# EAGLE design 388_Project (EAGLE 7.7.0)
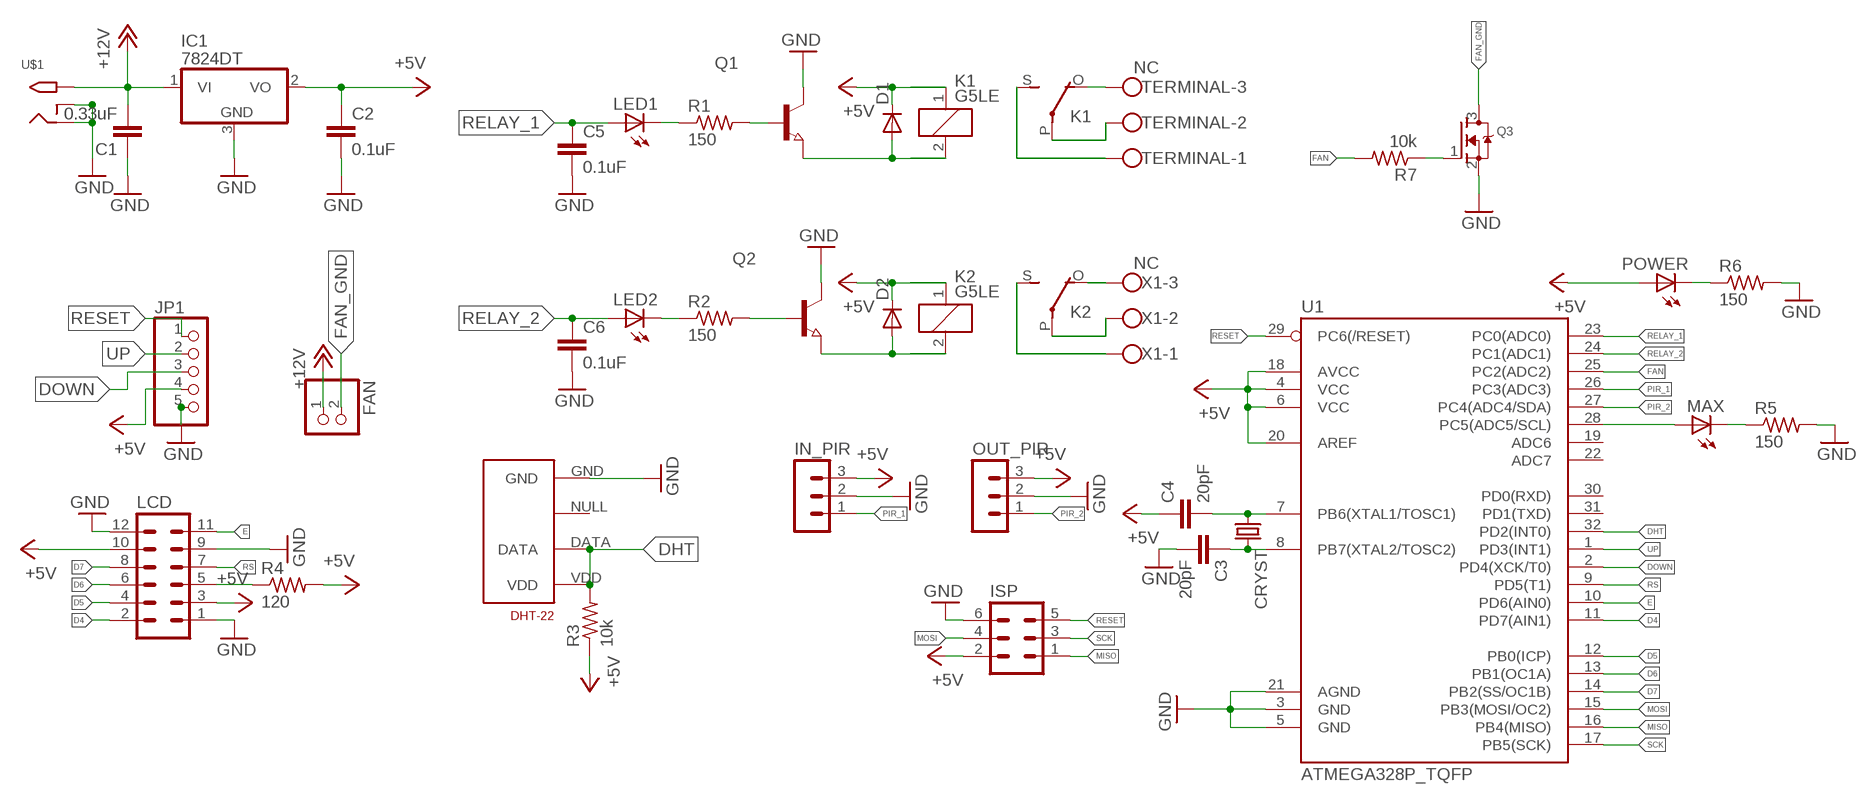
[diagram p0: schematic, sheet 1]

## Parts
C1  0.33uF  CAP0805  [0805]
C2  0.1uF  CAP0805  [0805]
C3  20pF  CAP0805  [0805]
C4  20pF  CAP0805  [0805]
C5  0.1uF  CAP0805  [0805]
C6  0.1uF  CAP0805  [0805]
CRYST  CRYSTALHC49UP  [HC49UP]
D1  DIODE-DO-214AC  [DO-214AC]
D2  DIODE-DO-214AC  [DO-214AC]
DHT-22  RHT03_DHT-22_AM2302RA  [RHT03_DHT-22/RA]
FAN  JST_2PIN-SMT  [JST-PH-2-SMT]
IC1  7824DT  [TO252]
IN_PIR  MA03-1  [MA03-1]
ISP  MA03-2  [MA03-2]
JP1  PINHD-1X5  [1X05]
K1  G5LE  [G5LE]
K2  G5LE  [G5LE]
LCD  MA06-2  [MA06-2]
LED1  LEDSML0805  [SML0805]
LED2  LEDSML0805  [SML0805]
MAX  LEDSML0805  [SML0805]
OUT_PIR  MA03-1  [MA03-1]
POWER  LEDSML0805  [SML0805]
Q1  NPN-TRANSISTOR_SOT23  [SOT23]
Q2  NPN-TRANSISTOR_SOT23  [SOT23]
Q3  MOSFET-NREFLOW  [SOT23]
R1  150  R-US_M0805  [M0805]
R2  150  R-US_M0805  [M0805]
R3  10k  R-US_M0805  [M0805]
R4  120  R-US_M0805  [M0805]
R5  150  R-US_M0805  [M0805]
R6  150  R-US_M0805  [M0805]
R7  10k  R-US_M0805  [M0805]
TERMINAL  NC  W237-103  [W237-103]
U1  ATMEGA328P_TQFP  [TQFP32-08]
U$1  2.1MMJACKTHM  [PJ-102A]
X1  NC  W237-103  [W237-103]

## Nets
+5V: C2.1 C4.1 D1.C D2.C IC1.2(VO) IN_PIR.3 ISP.2 JP1.4 K1.1 K2.1 LCD.3 LCD.10 OUT_PIR.3 POWER.A R3.1 R4.2 U1.4(VCC) U1.6(VCC) U1.18(AVCC) U1.20(AREF)
+12V: C1.2 FAN.1 IC1.1(VI) U$1.TIP
D4: LCD.2 U1.11(PD7(AIN1))
D5: LCD.4 U1.12(PB0(ICP))
D6: LCD.6 U1.13(PB1(OC1A))
D7: LCD.8 U1.14(PB2(SS/OC1B))
DHT: DHT-22.DATA DHT-22.VDD R3.2 U1.32(PD2(INT0))
DOWN: JP1.3 U1.2(PD4(XCK/T0))
E: LCD.11 U1.10(PD6(AIN0))
FAN: R7.2 U1.25(PC2(ADC2))
FAN_GND: FAN.2 Q3.3(D)
GND: C1.1 C2.2 C3.2 C5.2 C6.2 DHT-22.GND IC1.3(GND) IN_PIR.2 ISP.6 JP1.5 LCD.1 LCD.9 LCD.12 OUT_PIR.2 Q1.3(C) Q2.3(C) Q3.2(S) R5.2 R6.2 U1.3(GND) U1.5(GND) U1.21(AGND) U$1.RING U$1.RING_SW
MISO: ISP.1 U1.16(PB4(MISO))
MOSI: ISP.4 U1.15(PB3(MOSI/OC2))
N$1: K1.O(2:O) TERMINAL.3
N$2: Q3.1(G) R7.1
N$3: C3.1 CRYST.2 U1.8(PB7(XTAL2/TOSC2))
N$4: C4.2 CRYST.1 U1.7(PB6(XTAL1/TOSC1))
N$5: K1.S(2:S) TERMINAL.1
N$6: K1.P(2:P) TERMINAL.2
N$7: LED1.C R1.1
N$8: LED2.C R2.1
N$9: Q1.1(B) R1.2
N$10: Q2.1(B) R2.2
N$11: D1.A K1.2 Q1.2(E)
N$12: D2.A K2.2 Q2.2(E)
N$13: MAX.A U1.28(PC5(ADC5/SCL))
N$14: MAX.C R5.1
N$15: POWER.C R6.1
N$16: K2.O(2:O) X1.3
N$17: K2.S(2:S) X1.1
N$18: K2.P(2:P) X1.2
N$25: LCD.5 R4.1
PIR_1: IN_PIR.1 U1.26(PC3(ADC3))
PIR_2: OUT_PIR.1 U1.27(PC4(ADC4/SDA))
RELAY_1: C5.1 LED1.A U1.23(PC0(ADC0))
RELAY_2: C6.1 LED2.A U1.24(PC1(ADC1))
RESET: ISP.5 JP1.1 U1.29(PC6(/RESET))
RS: LCD.7 U1.9(PD5(T1))
SCK: ISP.3 U1.17(PB5(SCK))
UP: JP1.2 U1.1(PD3(INT1))
Unconnected: DHT-22.NULL U1.19(ADC6) U1.22(ADC7) U1.30(PD0(RXD)) U1.31(PD1(TXD))

## Library data of the parts
C1-C6 = SparkFun-Capacitors:CAP: Capacitor Standard 0603 ceramic capacitor, and 0.1" leaded capacitor.
CRYST = crystal:CRYSTAL: CRYSTAL; OC_FARNELL: unknown; OC_NEWARK: unknown
D1 D2 = diode:DIODE-: DIODE
DHT-22 = RHT03_DHT-22_AM2302:RHT03_DHT-22_AM2302: RHT03 / DHT-22 / AM2302 Packages and symbol for the RHT03 / DHT-22 relative humidity and temperature sensor. Note: The AM2302 is a wired version of the DHT-22 which typically requires less clearance and is thus provided as a separate package.; PROD_ID: SEN-10167
FAN = adafruit:JST_2PIN: JST 2-Pin Connectors of various flavors SMT-RA (S2B-PH-SM4) 4UConnector #17311 SMT (B2B-PH-SM4) THM-RA (S2B-PH) THM (B2B-PH)
IC1 = linear:78*: Positive VOLTAGE REGULATOR Source: http://cache.national.com/ds/LM/LM78L05.pdf http://www.fairchildsemi.com/ds/LM/LM7805.pdf
IN_PIR OUT_PIR = con-lstb:MA03-1: PIN HEADER; OC_FARNELL: unknown; OC_NEWARK: unknown
ISP = con-lstb:MA03-2: PIN HEADER; OC_FARNELL: unknown; OC_NEWARK: unknown
JP1 = pinhead:PINHD-1X5: PIN HEADER
K1 K2 = ECE388:G5LE: RELAY 1 x switch, 10 A/120 V AC, 8 A/30 V DC, Omron; OC_FARNELL: unknown; OC_NEWARK: unknown
LCD = con-lstb:MA06-2: PIN HEADER; OC_FARNELL: unknown; OC_NEWARK: unknown
LED1 LED2 MAX POWER = led:LED: LED OSRAM: - CHIPLED LG R971, LG N971, LY N971, LG Q971, LY Q971, LO R971, LY R971 LH N974, LH R974 LS Q976, LO Q976, LY Q976 LO Q996 - Hyper CHIPLED LW Q18S LB Q993, LB Q99A, LB R99A - SideLED LS A670, LO A670, LY A670, LG A670, LP A670 LB A673, LV A673, LT A673, LW A673 LH A674 LY A675 LS A676, LA A676, LO A676, LY A676, LW A676 LS A679, LY A679, LG A679 - Hyper Micro SIDELED® LS Y876, LA Y876, LO Y876, LY Y876 LT Y87S - SmartLED LW L88C, LW L88S LB L89C, LB L89S, LG L890 LS L89K, LO L89K, LY L89K LS L896, LA L896, LO L896, LY L896 - TOPLED LS T670, LO T670, LY T670, LG T670, LP T670 LSG T670, LSP T670, LSY T670, LOP T670, LYG T670 LG T671, LOG T671, LSG T671 LB T673, LV T673, LT T673, LW T673 LH T674 LS T676, LA T676, LO T676, LY T676, LB T676, LH T676, LSB T676, LW T676 LB T67C, LV T67C, LT T67C, LS T67K, LO T67K, LY T67K, LW E67C LS E67B, LA E67B, LO E67B, LY E67B, LB E67C, LV E67C, LT E67C LW T67C LS T679, LY T679, LG T679 LS T770, LO T770, LY T770, LG T770, LP T770 LB T773, LV T773, LT T773, LW T773 LH T774 LS E675, LA E675, LY E675, LS T675 LS T776, LA T776, LO T776, LY T776, LB T776 LHGB T686 LT T68C, LB T68C - Hyper Mini TOPLED® LB M676 - Mini TOPLED Santana® LG M470 LS M47K, LO M47K, LY M47K Source: http://www.osram.convergy.de LUXEON: - LUMILED® LXK2-PW12-R00, LXK2-PW12-S00, LXK2-PW14-U00, LXK2-PW14-V00 LXK2-PM12-R00, LXK2-PM12-S00, LXK2-PM14-U00 LXK2-PE12-Q00, LXK2-PE12-R00, LXK2-PE12-S00, LXK2-PE14-T00, LXK2-PE14-U00 LXK2-PB12-K00, LXK2-PB12-L00, LXK2-PB12-M00, LXK2-PB14-N00, LXK2-PB14-P00, LXK2-PB14-Q00 LXK2-PR12-L00, LXK2-PR12-M00, LXK2-PR14-Q00, LXK2-PR14-R00 LXK2-PD12-Q00, LXK2-PD12-R00, LXK2-PD12-S00 LXK2-PH12-R00, LXK2-PH12-S00 LXK2-PL12-P00, LXK2-PL12-Q00, LXK2-PL12-R00 Source: www.luxeon.com KINGBRIGHT: KA-3528ASYC Source: www.kingbright.com
Q1 Q2 = semicon-smd-ipc:NPN-TRANSISTOR_: NPN TRANSISTOR
Q3 = adafruit:MOSFET-N: N-Channel Mosfet 2N7002E - 60V 260mA SOT23 [Digikey: 2N7002ET1GOSTR-ND] - REEL BSH103 - 30V 850mA SOT23 [Digikey: 568-5013-1-ND]
R1-R7 = resistor:R-US_: RESISTOR, American symbol
TERMINAL X1 = con-wago-500:W237-103: WAGO SCREW CLAMP; MPN: 237-103; OC_FARNELL: unknown; OC_NEWARK: 18M7116
U1 = SparkFun-DigitalIC:ATMEGA328P_TQFP; PROD_ID: IC-09069
U$1 = ECE388:2.1MMJACK: 2.1mm x 5.5mm THM DC jack with internal switch. Digikey part #PJ-102A, 4UCON part #05537 2.1mm x 5.5mm SMT DC jack with internal switch. Digikey part #PJ-002A-SMT, 4UCON part #03267 By microbuilder.eu & adafruit.com

## Board
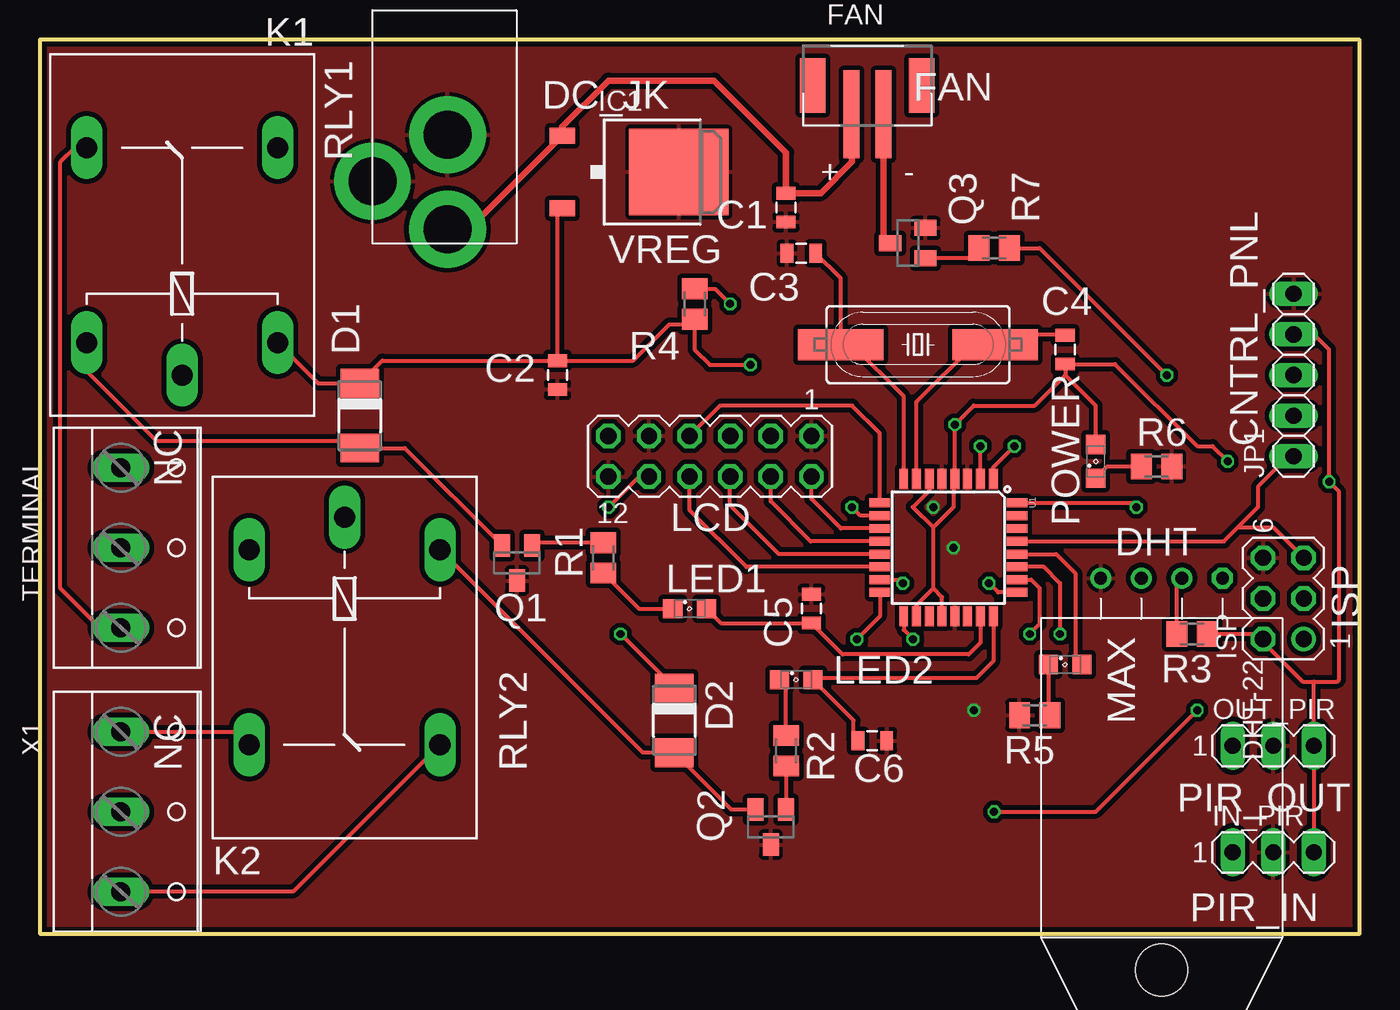
[diagram p1: board, top side]
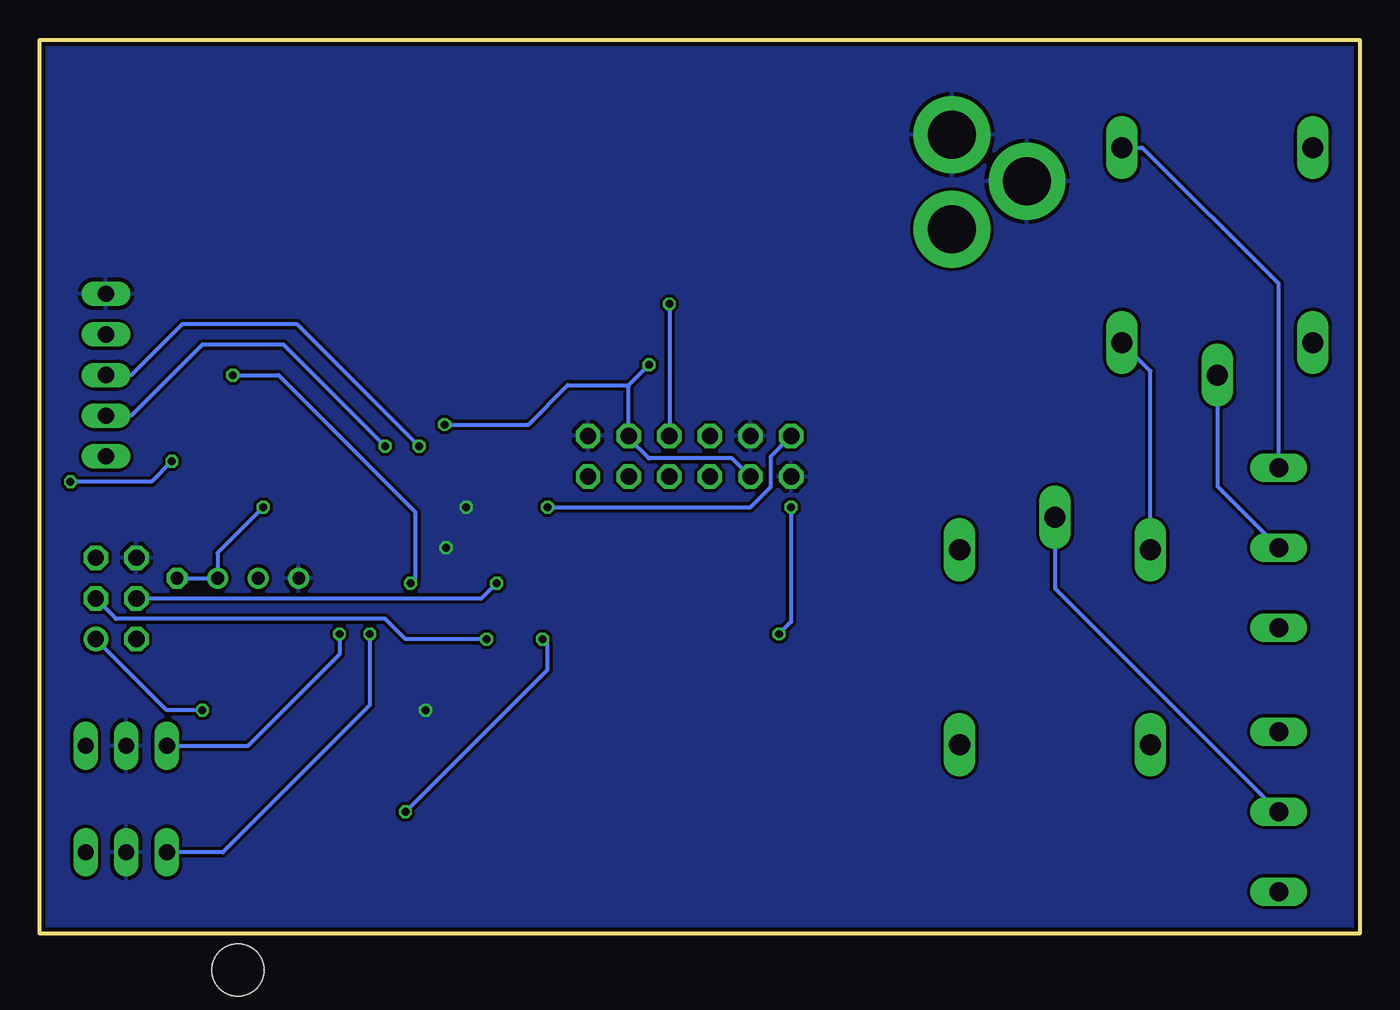
[diagram p2: board, bottom side, seen from below]

Size 82.55 x 55.88 mm. Coordinates in mm from the lower left corner, seen from the top.
Outline: 0,0 82.55,0 82.55,55.88 0,55.88 0,0
Copper layers (1*16): Top 0.035mm / dielectric 1.5mm / Bottom 0.035mm
Design rules "Dirty8TS": minimum track width 8mil, minimum drill 15mil, track to track 8mil, track to pad 8mil, pad to pad 8mil, via to via 8mil, smd to smd 0mil, copper to edge 10mil, drill to drill 10mil, minimum pad ring 10mil, minimum via ring 6mil, stop-mask expansion 2mil, vias tented up to drill 25mil, thermal gap 10mil

### Footprints (pad centres in the part's own frame; a part is rotated, then mirrored left to right if it is on the bottom)
0805 = smd 0.8 x 1.2: 1 -0.9,0; 2 0.9,0
HC49UP = smd 5.334 x 1.93: 1 -4.826,0; 2 4.826,0
DO-214AC = smd 1.8 x 2.4: A 2.025,0; C -2.025,0
RHT03_DHT-22/RA = drill 0.8: DATA -1.27,0; GND 3.81,0; NULL 1.27,0 | drill 0.8 octagon: VDD -3.81,0 | hole 3.25: 0,24.5
JST-PH-2-SMT = smd 1 x 5.5: 1 -1,-1.8; 2 1,-1.8 | smd 1.6 x 3.4: NC1 -3.4,0; NC2 3.4,0
TO252 = smd 1 x 1.6: 1 -2.28,-4.8; 2 2.28,-4.8 | smd 5.4 x 6.2: 3 0,2.5
MA03-1 = drill 1.016 long: 1 -2.54,0; 2 0,0; 3 2.54,0
MA03-2 = drill 1.016: 1 -2.54,-1.27 | drill 1.016 octagon: 2 -2.54,1.27; 3 0,-1.27; 4 0,1.27; 5 2.54,-1.27; 6 2.54,1.27
1X05 = drill 1.016 long: 1 -5.08,0; 2 -2.54,0; 3 0,0; 4 2.54,0; 5 5.08,0
G5LE = drill 1.321 long: 1 -7.493,-5.969; 2 -7.493,5.969; O 4.699,5.969; P -9.525,0; S 4.699,-5.969
MA06-2 = drill 1.016 octagon: 1 -6.35,-1.27; 2 -6.35,1.27; 3 -3.81,-1.27; 4 -3.81,1.27; 5 -1.27,-1.27; 6 -1.27,1.27; 7 1.27,-1.27; 8 1.27,1.27; 9 3.81,-1.27; 10 3.81,1.27; 11 6.35,-1.27; 12 6.35,1.27
SML0805 = smd 1.2 x 1.2: A 1.05,0; C -1.05,0
SOT23 = smd 1 x 1.4: 1 -0.95,-1.1; 2 0.95,-1.1; 3 0,1.1
M0805 = smd 1.3 x 1.6: 1 -0.95,0; 2 0.95,0
W237-103 = drill 1.194 long: 1 -5,-1.29; 2 0,-1.29; 3 5,-1.29
TQFP32-08 = smd 1.27 x 0.559: 1 -4.293,2.8; 2 -4.293,2; 3 -4.293,1.2; 4 -4.293,0.4; 5 -4.293,-0.4; 6 -4.293,-1.2; 7 -4.293,-2; 8 -4.293,-2.8; 17 4.293,-2.8; 18 4.293,-2; 19 4.293,-1.2; 20 4.293,-0.4; 21 4.293,0.4; 22 4.293,1.2; 23 4.293,2; 24 4.293,2.8 | smd 0.559 x 1.27: 9 -2.8,-4.293; 10 -2,-4.293; 11 -1.2,-4.293; 12 -0.4,-4.293; 13 0.4,-4.293; 14 1.2,-4.293; 15 2,-4.293; 16 2.8,-4.293; 25 2.8,4.293; 26 2,4.293; 27 1.2,4.293; 28 0.4,4.293; 29 -0.4,4.293; 30 -1.2,4.293; 31 -2,4.293; 32 -2.8,4.293
PJ-102A = drill 3 pad 4.8: RING 0.1,-3.39; RING_SW -4.6,-6.29; TIP 0.1,-9.29

### Placement (x,y rotation side)
C1  46.67,45.4 90 top
C2  32.38,34.92 270 top
C3  47.62,42.55 180 top
C4  64.14,36.51 90 top
C5  48.26,20.32 90 top
C6  52.07,12.06 0 top
CRYST  54.93,36.83 180 top
D1  20,32.38 270 top
D2  39.69,13.34 270 top
DHT-22  70.17,22.23 180 top
FAN  51.75,53.02 0 top
IC1  37.47,47.62 270 top
IN_PIR  77.15,5.08 0 top
ISP  77.79,20.95 90 top
JP1  78.42,34.92 90 top
K1  8.89,44.45 90 top
K2  19.05,16.51 270 top
LCD  41.91,29.84 180 top
LED1  40.64,20.32 0 top
LED2  47.31,15.88 0 top
MAX  64.14,16.83 0 top
OUT_PIR  77.15,11.75 0 top
POWER  66.04,29.53 90 top
Q1  29.84,23.18 180 top
Q2  45.72,6.67 180 top
Q3  54.29,43.18 90 top
R1  35.24,23.5 90 top
R2  46.67,11.43 270 top
R3  72.07,18.73 180 top
R4  40.96,39.37 270 top
R5  62.23,13.65 180 top
R6  69.85,29.21 0 top
R7  59.69,42.86 0 top
TERMINAL  6.35,24.13 270 top
U1  56.83,24.13 270 top
U$1  25.4,53.34 0 top
X1  6.35,7.62 270 top

### Tracks (layer width: path | path; a pad name or v marks a point on that pad's centre or on a via)
+5V  (via drill 0.5, 0.5 pad 0.41)
  Top 0.254: IN_PIR.3 OUT_PIR.3 79.69,15.75 | 56.52,19.92 U1.20 56.43,21.04 55.88,21.59 | C2.1 32.38,45.06 IC1.2 | v44.45,35.56 41.91,35.56 40.96,36.51 R4.2 40.64,38.1 39.37,38.1 37.09,35.83 C2.1 | v74.3,29.53 73.34,30.48 72.39,30.48 67.26,35.61 C4.1 64.14,34.92 | LCD.10 37.47,28.57 v35.56,26.67 | 64.14,34.92 62.23,33.02 58.42,33.02 v57.23,31.83 U1.4 57.15,28.34 57.15,26.67 55.88,25.4 | POWER.A 66.04,33.02 64.14,34.92 | U1.18 54.83,20.54 55.88,21.59 | 55.88,21.59 55.88,25.4 | R3.1 76.2,18.73 ISP.2 76.52,18.22 78.99,15.75 79.69,15.75 | 79.69,15.75 81.15,15.75 81.28,15.88 81.28,27.62 v80.64,28.26 80.64,36.51 79.69,37.47 JP1.4 | U1.6 55.63,27.69 54.61,26.67 55.88,25.4 | v36.31,18.73 D2.C | K1.1 17.41,34.41 D1.C 21.42,35.83 C2.1
  Bottom 0.254: v74.3,29.53 75.56,28.26 v80.64,28.26 | LCD.10 39.24,29.72 44.45,29.72 45.72,30.99 LCD.3 45.72,34.29 | 45.72,34.29 v44.45,35.56 | v57.23,31.83 51.99,31.83 49.53,34.29 45.72,34.29 | v35.56,26.67 35.56,19.49 v36.31,18.73 | K2.1 13.08,35.18 K1.1
+12V
  Top 0.406: U$1.TIP 26.81,44.05 IC1.1 32.66,50.45 35.56,53.34 42.17,53.34 46.67,48.84 C1.2 48.84,46.3 50.8,48.26 50.8,51.17 FAN.1
D4
  Top 0.254: U1.11 50.11,25.33 48.26,27.18 LCD.2
D5
  Top 0.254: U1.12 48.21,24.53 45.72,27.02 LCD.4
D6
  Top 0.254: U1.13 46.22,23.73 43.18,26.77 LCD.6
D7
  Top 0.254: U1.14 44.18,22.93 40.64,26.47 LCD.8
DHT  (via drill 0.5)
  Top 0.254: 61.18,26.99 U1.32 68.32,26.93 v68.58,26.67 | R3.2 71.12,21.91 DHT-22.DATA
  Bottom 0.254: DHT-22.VDD DHT-22.DATA 71.44,23.81 v68.58,26.67
DOWN  (via drill 0.5)
  Top 0.254: U1.2 v58.83,30.48
  Bottom 0.254: 78.11,34.92 JP1.3 76.83,34.92 73.66,38.1 66.45,38.1 v58.83,30.48
E  (via drill 0.5)
  Top 0.254: U1.10 51.34,26.13 v50.8,26.67
  Bottom 0.254: v50.8,26.67 38.1,26.67 36.83,27.94 36.83,29.84 LCD.11
FAN  (via drill 0.5 pad 0.41)
  Top 0.254: U1.25 59.95,21.33 v59.37,21.91 | R7.2 62.55,42.86 v70.48,34.92
  Bottom 0.254: v59.37,21.91 59.05,22.23 59.05,26.35 67.63,34.92 v70.48,34.92
FAN_GND
  Top 0.406: FAN.2 52.75,43.62 Q3.3
GND  (via drill 0.5)
  other vias: 58.42,13.97 57.15,24.13 55.88,26.67
  pour Top (isolate 0.305): 0,55.88 82.55,55.88 82.55,0 0,0
  pour Bottom: 0,55.88 82.55,55.88 82.55,0 0,0
MISO  (via drill 0.5, 0.5 pad 0.41)
  Top 0.254: U1.16 52.54,19.84 v51.12,18.41 | v59.69,7.62 66.04,7.62 v72.39,13.97
  Bottom 0.254: 79.38,18.41 ISP.1 74.61,13.97 v72.39,13.97 | v51.12,18.41 50.8,18.1 50.8,16.51 v59.69,7.62
MOSI  (via drill 0.5)
  Top 0.254: U1.15 53.75,22.13 v53.98,21.91
  Bottom 0.254: v53.98,21.91 54.93,20.95 ISP.4
N$1
  Top 0.254: TERMINAL.3 3.73,19.13 1.27,21.59 1.27,48.26 2.16,49.15 K1.O
N$2
  Top 0.254: R7.1 58.11,42.23 Q3.1
N$3
  Top 0.254: U1.8 54.03,33.6 50.8,36.83 CRYST.2 50.1,40.97 C3.1
N$4
  Top 0.254: C4.2 64.08,37.47 62.23,37.47 61.59,36.83 CRYST.1 58.42,36.83 54.83,33.24 U1.7
N$5
  Bottom 0.254: TERMINAL.1 5.06,40.62 13.59,49.15 K1.S
N$6
  Bottom 0.254: K1.P 8.89,27.96 TERMINAL.2
N$7
  Top 0.254: R1.1 37.47,20.32 LED1.C
N$8
  Top 0.254: R2.1 46.67,15.46 LED2.C
N$9
  Top 0.254: Q1.1 30.96,24.45 R1.2 35.56,24.13
N$10
  Top 0.254: R2.2 Q2.1
N$11
  Top 0.254: K1.2 2.92,35.18 7.3,30.8 19.57,30.8 D1.A 22.81,30.36 Q1.2
N$12
  Top 0.254: Q2.2 43.23,7.77 D2.A 37.71,11.31 K2.2
N$13
  Top 0.254: U1.28 63.58,23.73 64.77,22.54 64.77,17.24 MAX.A
N$14
  Top 0.254: MAX.C 63.09,13.75 R5.1
N$15
  Top 0.254: POWER.C 66.77,29.21 R6.1
N$16
  Top 0.254: K2.O 15.83,2.62 X1.3
N$17
  Top 0.254: X1.1 12.27,12.62 K2.S
N$18
  Bottom 0.254: K2.P 19.05,21.59 5.08,7.62 X1.2
N$25  (via drill 0.5)
  Top 0.254: R4.1 42.23,40.32 v43.18,39.37
  Bottom 0.254: v43.18,39.37 LCD.5
PIR_1  (via drill 0.5)
  Top 0.254: v61.91,18.73 62.55,19.37 62.55,21.59 62.01,22.13 U1.26
  Bottom 0.254: v61.91,18.73 61.91,14.29 71.12,5.08 IN_PIR.1
PIR_2  (via drill 0.5 pad 0.41)
  Top 0.254: 61.2,22.86 U1.27 62.8,22.93 63.82,21.91 v63.82,18.73
  Bottom 0.254: v63.82,18.73 63.82,17.46 69.53,11.75 OUT_PIR.1
RELAY_1
  Top 0.254: U1.23 58.83,18.19 58.1,17.46 50.22,17.46 C5.1 42.59,19.42 LED1.A
RELAY_2
  Top 0.254: C6.1 50.9,12.06 50.9,13.34 LED2.A 48.46,15.98 58.57,15.98 59.63,17.04 U1.24
RESET
  Top 0.254: U1.29 74.06,24.53 74.93,25.4 | 74.93,25.4 77.15,25.4 ISP.5 | JP1.1 78.11,29.84 76.2,27.94 76.2,26.67 74.93,25.4
RS
  Top 0.254: U1.9 52.54,31.28 50.8,33.02 42.55,33.02 LCD.7
SCK  (via drill 0.5)
  Top 0.254: 54.03,19.43 U1.17 54.03,18.99 v54.61,18.41
  Bottom 0.254: ISP.3 77.79,19.68 60.96,19.68 59.69,18.41 v54.61,18.41
UP  (via drill 0.5)
  Top 0.254: U1.1 59.63,29.15 v60.96,30.48
  Bottom 0.254: v60.96,30.48 67.31,36.83 72.39,36.83 76.83,32.38 JP1.2

### Text on the board
tSilk: RLY1 | DC_JK | FAN | VREG | CNTRL_PNL | NC | DHT | ISP | NC | PIR_OUT | PIR_IN
_tsilk: RLY2